# Altium project RFID1.PrjPcb
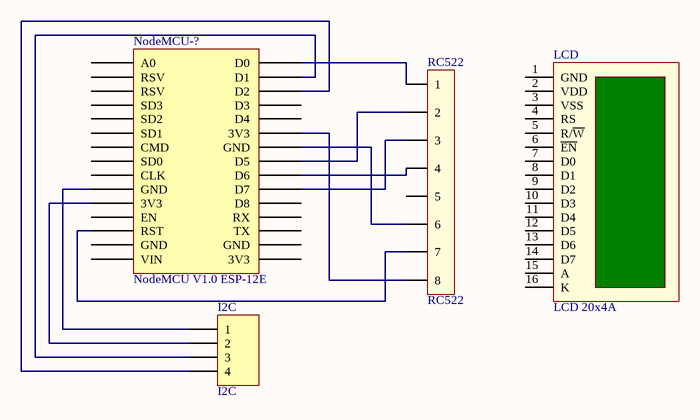
[diagram p0: Sheet1.SchDoc]
1 sheet, 4 parts. Net scope: global (net labels, ports and power ports of the same name join across sheets).
Board file: PCB1.PcbDoc

## Sheet Sheet1.SchDoc
size A4

### Parts
I2C  I2C  [HDR1X4]
LCD  LCD 20x4A  [LCD20X4A]
NodeMCU-?  NodeMCU V1.0 ESP-12E  [NodeMCU V1.0 ESP-12E]
RC522  RC522  [HED8V]

### Nets
NetI2C_1: I2C.1 NodeMCU-?.GND
NetI2C_2: I2C.2 NodeMCU-?.3V3
NetI2C_3: I2C.3 NodeMCU-?.D1
NetI2C_4: I2C.4 NodeMCU-?.D2
NetNodeMCU-?_3V3: NodeMCU-?.3V3 RC522.8
NetNodeMCU-?_D0: NodeMCU-?.D0 RC522.1
NetNodeMCU-?_D5: NodeMCU-?.D5 RC522.2
NetNodeMCU-?_D6: NodeMCU-?.D6 RC522.4
NetNodeMCU-?_D7: NodeMCU-?.D7 RC522.3
NetNodeMCU-?_GND: NodeMCU-?.GND RC522.6
NetNodeMCU-?_RST: NodeMCU-?.RST RC522.7

Not connected (* = marked no-connect by the designer): LCD 1(GND) 2(VDD) 3(VSS) 4(RS) 5(R/~{W}) 6(~{EN}) 7(D0) 8(D1) 9(D2) 10(D3) 11(D4) 12(D5) 13(D6) 14(D7) 15(A) 16(K); NodeMCU-? A0 CLK CMD D3 D4 D8 EN RSV RX SD0 SD1 SD2 SD3 TX VIN; RC522 5

### Library data of the parts
I2C = Header 4: Header, 4-Pin; LatestRevisionDate: 17-Jul-2002; LatestRevisionNote: Re-released for DXP Platform.; Publisher: Altium Limited
LCD = LCD20x4A: LCD dipslay 20 char, 4 line; Value: Jum 40; Value: LCD 20x4A
NodeMCU-? = NodeMCU V1.0 ESP-12E: NodeMCU V1.0 ESP8266 (ESP-12E)
RC522 = HED8V: Header 8 Vit Broad